# Altium schematic sheet Voltage Source.SchDoc
size A4; SheetNumber: 3; SheetTotal: 6; ProjectTitle: PD_SMARTKEY_EMN-EVAN_V2
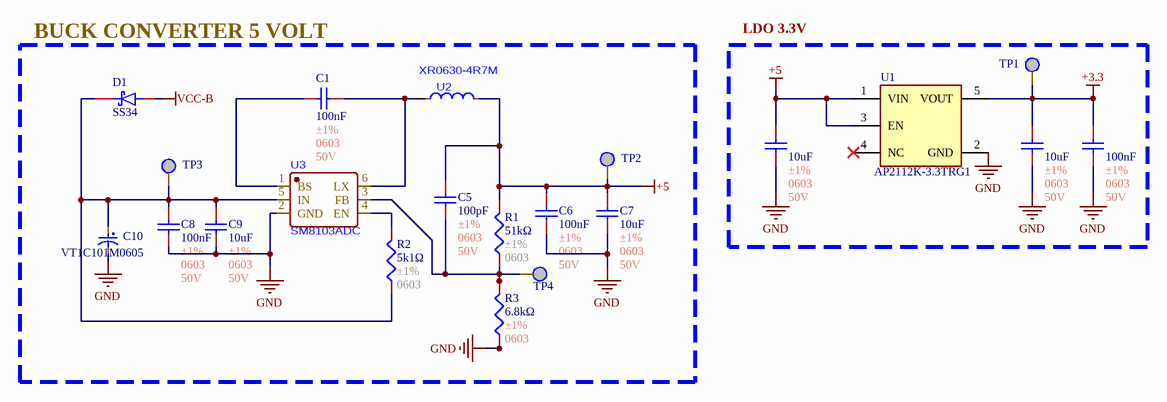
[diagram p0: Voltage Source.SchDoc]

## Parts
C1  100nF  Tolerance: ±1%  Package: 0603  Voltage Rating: 50V  [C0603]
C2  10uF  Tolerance: ±1%  Package: 0603  Voltage Rating: 50V  [C0603]
C3  10uF  Tolerance: ±1%  Package: 0603  Voltage Rating: 50V  [C0603]
C4  100nF  Tolerance: ±1%  Package: 0603  Voltage Rating: 50V  [C0603]
C5  100pF  Tolerance: ±1%  Package: 0603  Voltage Rating: 50V  [C0603]
C6  100nF  Tolerance: ±1%  Package: 0603  Voltage Rating: 50V  [C0603]
C7  10uF  Tolerance: ±1%  Package: 0603  Voltage Rating: 50V  [C0603]
C8  100nF  Tolerance: ±1%  Package: 0603  Voltage Rating: 50V  [C0603]
C9  10uF  Tolerance: ±1%  Package: 0603  Voltage Rating: 50V  [C0603]
C10  VT1C101M0605  [C_100uF_16V_Aluminum]
D1  SS34  [SS34]
R1  51kΩ  Tolerance: ±1%  Package: 0603  [R0603]
R2  5k1Ω  Tolerance: ±1%  Package: 0603  [R0603]
R3  6.8kΩ  Tolerance: ±1%  Package: 0603  [R0603]
TP1  TP  [TP]  (value not drawn)
TP2  TP  [TP]  (value not drawn)
TP3  TP  [TP]  (value not drawn)
TP4  TP  [TP]  (value not drawn)
U1  AP2112K-3.3TRG1  [SOT23-5]
U2  XR0630-4R7M  [SMD,7x6.6mm]
U3  SM8103ADC  [TSOT-23-6]

## Blocks framed on the sheet
BUCK CONVERTER 5 VOLT: C1 C5-C10 D1 R1-R3 TP2-TP4 U2 U3
LDO 3.3V: C2-C4 TP1 U1

## Nets
+3.3: C3.1 C4.1 TP1.1 U1.5(VOUT)
+5: C2.1 C5.1 C6.1 C7.1 R1.2 TP2.1 U1.1(VIN) U1.3(EN) U2.2(F)
GND: C2.2 C3.2 C4.2 C6.2 C7.2 C8.2 C9.2 C10.2 R3.1 U1.2(GND) U3.2(GND)
VCC-B: D1.2
NetC1_1: C1.1 U2.1(S) U3.6(LX)
NetC1_2: C1.2 U3.1(BS)
NetC5_2: C5.2 R1.1 R3.2 TP4.1 U3.3(FB)
NetC8_1: C8.1 C9.1 C10.1 D1.1 R2.1 TP3.1 U3.5(IN)
NetR2_2: R2.2 U3.4(EN)

Not connected (* = marked no-connect by the designer): U1 4(NC)*

## Notes on the sheet
- Author:
- Title:
- Size:
- A4
- Project:
- Approved:
- Revision:
- Modified Date:
- CONFIDENTIAL
- Date:
- SW Version:

## Library data of the parts
C1 C6 C8 = C0603_100nF_±1%: Manufacturer: YAGEO; Mfr. Part #: CC0402FRNPO9BN100; LCSC Part #: C513681; Link: https://www.lcsc.com/product-detail/C513681.html?s_z=n_capital%2520yageo%252010pF%25200402; Capacitance: 100nF
C2 C3 = C0603_10uF_±1%: 50V 10pF NP0 ±1% 0402 Multilayer Ceramic Capacitors MLCC - SMD/SMT ROHS; Manufacturer: YAGEO; Mfr. Part #: CC0402FRNPO9BN100; LCSC Part #: C513681; Link: https://www.lcsc.com/product-detail/C513681.html?s_z=n_capital%2520yageo%252010pF%25200402; Capacitance: 10uF
C4 = C0603_100nF_±1%: 50V 10pF NP0 ±1% 0402 Multilayer Ceramic Capacitors MLCC - SMD/SMT ROHS; Manufacturer: YAGEO; Mfr. Part #: CC0402FRNPO9BN100; LCSC Part #: C513681; Link: https://www.lcsc.com/product-detail/C513681.html?s_z=n_capital%2520yageo%252010pF%25200402; Capacitance: 100nF
C5 = C0603_100pF_±1%: Manufacturer: YAGEO; Mfr. Part #: CC0402FRNPO9BN100; LCSC Part #: C513681; Link: https://www.lcsc.com/product-detail/C513681.html?s_z=n_capital%2520yageo%252010pF%25200402; Capacitance: 100pF
C7 C9 = C0603_10uF_±1%: Manufacturer: YAGEO; Mfr. Part #: CC0402FRNPO9BN100; LCSC Part #: C513681; Link: https://www.lcsc.com/product-detail/C513681.html?s_z=n_capital%2520yageo%252010pF%25200402; Capacitance: 10uF
C10 = C_100uF_16V_aluminum: 100uF 16V ±20% 63mA@120Hz SMD,D6.3xL5.4mm Aluminum Electrolytic Capacitors RoHS; Manufacturer: ROQANG; Key Attributes: CAP ALUM 100uF ±20% 16V SMD; Mfr. Part #: VT1C101M0605; LCSC Part #: C90273; Package: SMD,D6.3xL5.4mm; Link: https://www.lcsc.com/product-detail/C90273.html?s_z=n_capital%2520100uf%2520aluminum
D1 = SS34: 40V Independent 3A 550mV@3A SMA(DO-214AC) Schottky Diodes ROHS; Manufacturer: MDD(Microdiode Semiconductor); Mfr. Part #: SS34; LCSC Part #: C8678; Package: SMA(DO-214AC); Voltage - DC Reverse(Vr): 40V; Current - Rectified: 3A; Link: https://www.lcsc.com/product-detail/C8678.html?s_z=n_SS34
R1 = R0603_51kΩ_±1%: 100mW Thick Film Resistor 75V ±100ppm/℃ ±1% 51kΩ 0603 Chip Resistor - Surface Mount ROHS; Manufacturer: FOJAN; Mfr. Part #: FRC0603F5101TS; Key Attributes: RES 5.1kΩ ±1% 100mW 0603; LCSC Part #: C2907044; Link: https://www.lcsc.com/product-detail/C2907044.html?s_z=n_5k1%25200603; Resistance: 51kΩ
R2 = R0603_5k1Ω_±1%: 100mW Thick Film Resistor 75V ±100ppm/℃ ±1% 5.1kΩ 0603 Chip Resistor - Surface Mount ROHS; Manufacturer: FOJAN; Mfr. Part #: FRC0603F5101TS; Key Attributes: RES 5.1kΩ ±1% 100mW 0603; LCSC Part #: C2907044; Link: https://www.lcsc.com/product-detail/C2907044.html?s_z=n_5k1%25200603; Resistance: 5k1Ω
R3 = R0603_6.8kΩ_±1%_1: 6.8k; Manufacturer: YAGEO; Mfr. Part #: RC0402FR-0710RL; LCSC Part #: C138066; Resistance: 6.8kΩ; Link: https://www.lcsc.com/product-detail/C138066.html?s_z=n_resistor%25200402%252010R
U1 = AP2112K-3.3TRG1: Linear Voltage Regulator IC Positive Fixed 1 Output 600mA SOT23-5; MF: Diodes Inc.; Value: *; Purchase-URL: https://pricing.snapeda.com/search/part/AP2112K-3.3TRG1/?ref=eda; Package: SOT-753 Diodes Inc.; Availability: In Stock; Check_prices: https://www.snapeda.com/parts/AP2112K-3.3TRG1/Diodes+Inc./view-part/?ref=eda; Price: None; SnapEDA_Link: https://www.snapeda.com/parts/AP2112K-3.3TRG1/Diodes+Inc./view-part/?ref=snap; MP: AP2112K-3.3TRG1
U2 = FIXED IND 4.7uH 6A 33mΩ SMD,0630: Manufacturer: XR; MPN: XR0630-4R7M; LCSC Part #: C5307631; Packaging: SMD,7x6.6mm; Link: https://www.lcsc.com/product-detail/C5307631.html?s_z=n_q_t_INDUCTOR%25200630&spm=wm.fly.bg.0.xh___wm.ssy.tc.0.tz&lcsc_vid=FFlaVlZURFlbX1EAE1lbUlZfQwdeBlBRQ1VZBFdQQwUxVlNeRlRfU1ZRQlNZXzsOAxUeFF5JWBYZEEoKFBINSQcJGk4eFQsCAgIaSgADAwAHC0slQ1ZXV1NWWQkaCgg%3D
U3 = SM8103ADC: High Efficiency, 3.0A, 18V Input Synchronous Step Down Regulator; Manufacturer: Silergy; MPN: SM8103ADC; LCSC Part #: C479070; Packaging: TSOT-23-6; Link: https://www.lcsc.com/product-detail/C479070.html?s_z=s_p_SM8103ADC&spm=wm.fly.bg.0.xh&lcsc_vid=FFlaVlZURFlbX1EAE1lbUlZfQwdeBlBRQ1VZBFdQQwUxVlNeRlReUVRTQVFeUDsOAxUeFF5JWBYZEEoKFBINSQcJGk4dAgUUFAk%3D